# EAGLE design dev2-light (EAGLE 5.10)
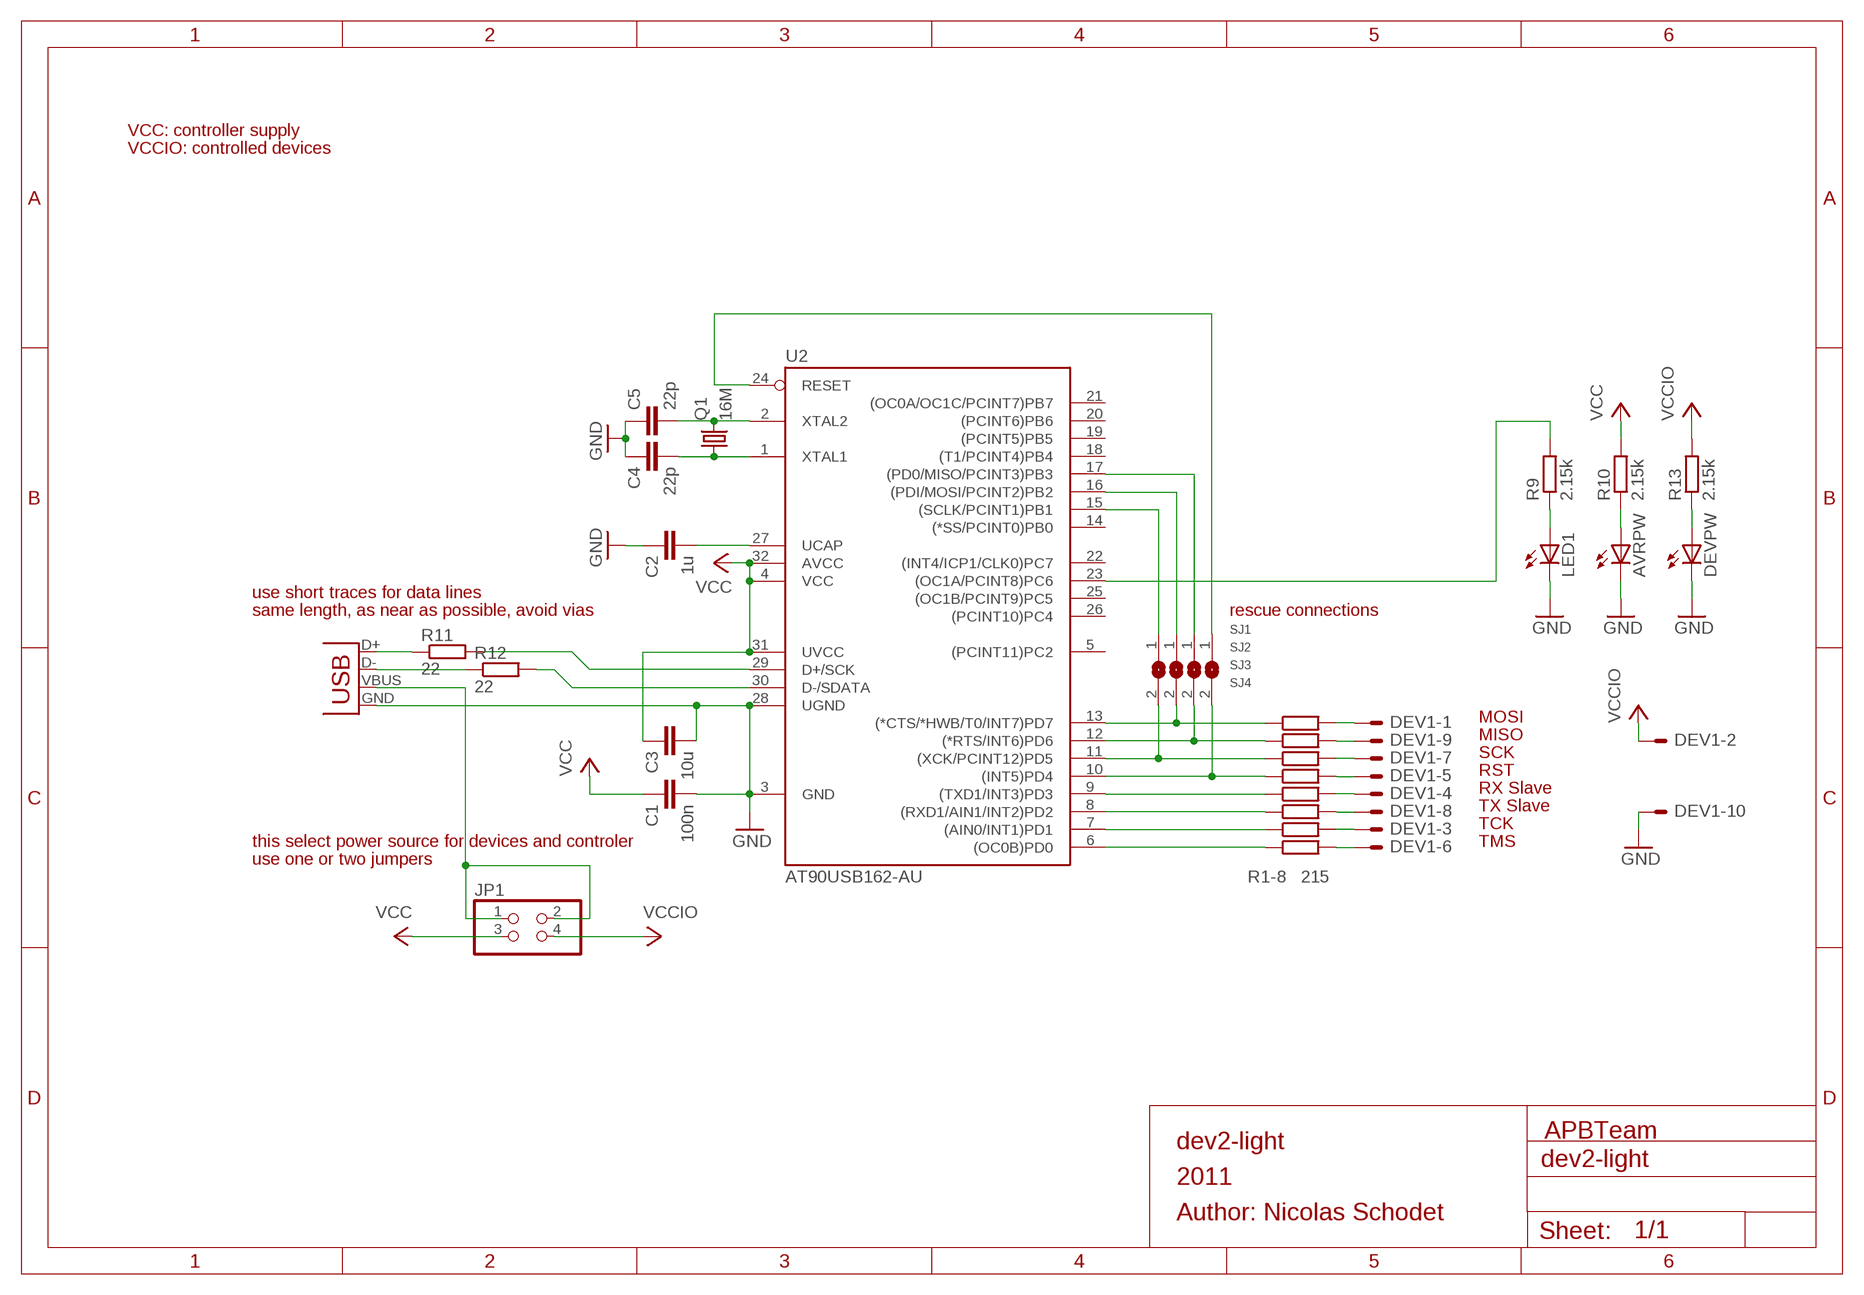
[diagram p0: schematic, sheet 1]

## Parts
AVRPW  LEDSMT1206  [1206]
C1  100n  C-EUC0603  [C0603]
C2  1u  C-EUC0603  [C0603]
C3  10u  C-EUC0603  [C0603]
C4  22p  C-EUC0603  [C0603]
C5  22p  C-EUC0603  [C0603]
DEV1  ML10E  [ML10]
DEVPW  LEDSMT1206  [1206]
JP1  PINHD-2X2  [2X02]
LED1  LEDSMT1206  [1206]
Q1  16M  QUARTZ  [ABM3]
R1  215  R-EU_R0603  [R0603]
R2  215  R-EU_R0603  [R0603]
R3  215  R-EU_R0603  [R0603]
R4  215  R-EU_R0603  [R0603]
R5  215  R-EU_R0603  [R0603]
R6  215  R-EU_R0603  [R0603]
R7  215  R-EU_R0603  [R0603]
R8  215  R-EU_R0603  [R0603]
R9  2.15k  R-EU_R0603  [R0603]
R10  2.15k  R-EU_R0603  [R0603]
R11  22  R-EU_R0603  [R0603]
R12  22  R-EU_R0603  [R0603]
R13  2.15k  R-EU_R0603  [R0603]
SJ1  SJ1SMD  [SJ1-SMD]
SJ2  SJ1SMD  [SJ1-SMD]
SJ3  SJ1SMD  [SJ1-SMD]
SJ4  SJ1SMD  [SJ1-SMD]
U2  AT90USB162-AU  [TQFP32-08]
X7  USB-MICROB-S  [USB-MICROB]

## Nets
AVRDM: R12.2 U2.30(D-/SDATA)
AVRDP: R11.2 U2.29(D+/SCK)
AVRPWLED: AVRPW.A R10.1
D0: R8.1 U2.6((OC0B)PD0)
D0D: DEV1.6 R8.2
D1: R7.1 U2.7((AIN0/INT1)PD1)
D1D: DEV1.3 R7.2
D2: R6.1 U2.8((RXD1/AIN1/INT2)PD2)
D2D: DEV1.8 R6.2
D3: R5.1 U2.9((TXD1/INT3)PD3)
D3D: DEV1.4 R5.2
D4: R4.1 SJ4.2 U2.10((INT5)PD4)
D4D: DEV1.5 R4.2
D5: R3.1 SJ1.2 U2.11((XCK/PCINT12)PD5)
D5D: DEV1.7 R3.2
D6: R2.1 SJ3.2 U2.12((*RTS/INT6)PD6)
D6D: DEV1.9 R2.2
D7: R1.1 SJ2.2 U2.13((*CTS/*HWB/T0/INT7)PD7)
D7D: DEV1.1 R1.2
DEVPWLED: DEVPW.A R13.1
DM: R12.1 X7.D-
DP: R11.1 X7.D+
GND [supply]: AVRPW.C C1.2 C2.1 C3.2 C4.1 C5.1 DEV1.10 DEVPW.C LED1.C U2.3(GND) U2.28(UGND) X7.GND
LED1L: LED1.A R9.1
MISO: SJ3.1 U2.17((PD0/MISO/PCINT3)PB3)
MOSI: SJ2.1 U2.16((PDI/MOSI/PCINT2)PB2)
PC6: R9.2 U2.23((OC1A/PCINT8)PC6)
RESET: SJ4.1 U2.24(RESET)
SCK: SJ1.1 U2.15((SCLK/PCINT1)PB1)
UCAP: C2.2 U2.27(UCAP)
VBUS: JP1.1 JP1.2 X7.VBUS
VCC [supply]: C1.1 C3.1 JP1.3 R10.2 U2.4(VCC) U2.31(UVCC) U2.32(AVCC)
VCCIO [supply]: DEV1.2 JP1.4 R13.2
XTAL1: C4.2 Q1.1 U2.1(XTAL1)
XTAL2: C5.2 Q1.2 U2.2(XTAL2)
Unconnected: U2.5((PCINT11)PC2) U2.14((*SS/PCINT0)PB0) U2.18((T1/PCINT4)PB4) U2.19((PCINT5)PB5) U2.20((PCINT6)PB6) U2.21((OC0A/OC1C/PCINT7)PB7) U2.22((INT4/ICP1/CLK0)PC7) U2.25((OC1B/PCINT9)PC5) U2.26((PCINT10)PC4)

## Notes on the sheet
- VCC: controller supply
- VCCIO: controlled devices
- use short traces for data lines
- same length, as near as possible, avoid vias | rescue connections
- MOSI
- MISO
- SCK
- RST
- RX Slave
- TX Slave
- TCK
- this select power source for devices and controler | TMS
- use one or two jumpers
- R1-8 | 215
- APBTeam
- dev2-light
- 2011
- Author: Nicolas Schodet

## Library data of the parts
AVRPW DEVPW LED1 = led:LED: LED OSRAM: - CHIPLED LG R971, LG N971, LY N971, LG Q971, LY Q971, LO R971, LY R971 LH N974, LH R974 LS Q976, LO Q976, LY Q976 LO Q996 - Hyper CHIPLED LW Q18S LB Q993, LB Q99A, LB R99A - SideLED LS A670, LO A670, LY A670, LG A670, LP A670 LB A673, LV A673, LT A673, LW A673 LH A674 LY A675 LS A676, LA A676, LO A676, LY A676, LW A676 LS A679, LY A679, LG A679 - Hyper Micro SIDELED® LS Y876, LA Y876, LO Y876, LY Y876 LT Y87S - SmartLED LW L88C, LW L88S LB L89C, LB L89S, LG L890 LS L89K, LO L89K, LY L89K LS L896, LA L896, LO L896, LY L896 - TOPLED LS T670, LO T670, LY T670, LG T670, LP T670 LSG T670, LSP T670, LSY T670, LOP T670, LYG T670 LG T671, LOG T671, LSG T671 LB T673, LV T673, LT T673, LW T673 LH T674 LS T676, LA T676, LO T676, LY T676, LB T676, LH T676, LSB T676, LW T676 LB T67C, LV T67C, LT T67C, LS T67K, LO T67K, LY T67K, LW E67C LS E67B, LA E67B, LO E67B, LY E67B, LB E67C, LV E67C, LT E67C LW T67C LS T679, LY T679, LG T679 LS T770, LO T770, LY T770, LG T770, LP T770 LB T773, LV T773, LT T773, LW T773 LH T774 LS E675, LA E675, LY E675, LS T675 LS T776, LA T776, LO T776, LY T776, LB T776 LHGB T686 LT T68C, LB T68C - Hyper Mini TOPLED® LB M676 - Mini TOPLED Santana® LG M470 LS M47K, LO M47K, LY M47K Source: http://www.osram.convergy.de LUXEON: - LUMILED® LXK2-PW12-R00, LXK2-PW12-S00, LXK2-PW14-U00, LXK2-PW14-V00 LXK2-PM12-R00, LXK2-PM12-S00, LXK2-PM14-U00 LXK2-PE12-Q00, LXK2-PE12-R00, LXK2-PE12-S00, LXK2-PE14-T00, LXK2-PE14-U00 LXK2-PB12-K00, LXK2-PB12-L00, LXK2-PB12-M00, LXK2-PB14-N00, LXK2-PB14-P00, LXK2-PB14-Q00 LXK2-PR12-L00, LXK2-PR12-M00, LXK2-PR14-Q00, LXK2-PR14-R00 LXK2-PD12-Q00, LXK2-PD12-R00, LXK2-PD12-S00 LXK2-PH12-R00, LXK2-PH12-S00 LXK2-PL12-P00, LXK2-PL12-Q00, LXK2-PL12-R00 Source: www.luxeon.com KINGBRIGHT: KA-3528ASYC Source: www.kingbright.com
C1-C5 = rcl:C-EU: CAPACITOR, European symbol
DEV1 = con-harting-ml:ML10?E: HARTING
JP1 = pinhead:PINHD-2X2: PIN HEADER
Q1 = ni-crystal:QUARTZ
R1-R13 = apbteam_rcl:R-EU_: RESISTOR, European symbol
SJ1-SJ4 = apbteam_jumper:SJ1: Jumper
U2 = at90usb:AT90USB162-*
X7 = apbteam_con-usb:USB: USB Connectors

## Net classes
1 supply: width 0.203 mm

## Board
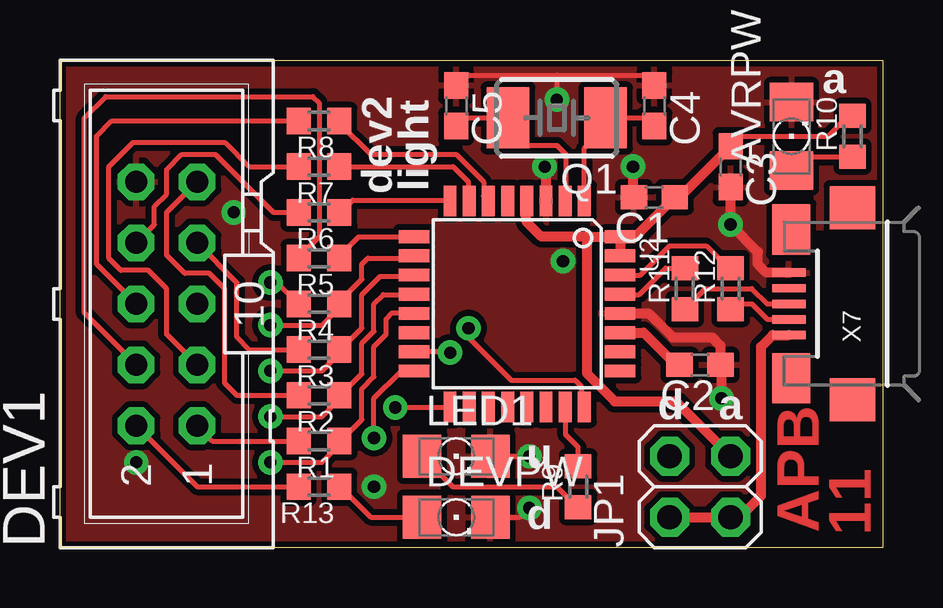
[diagram p1: board, top side]
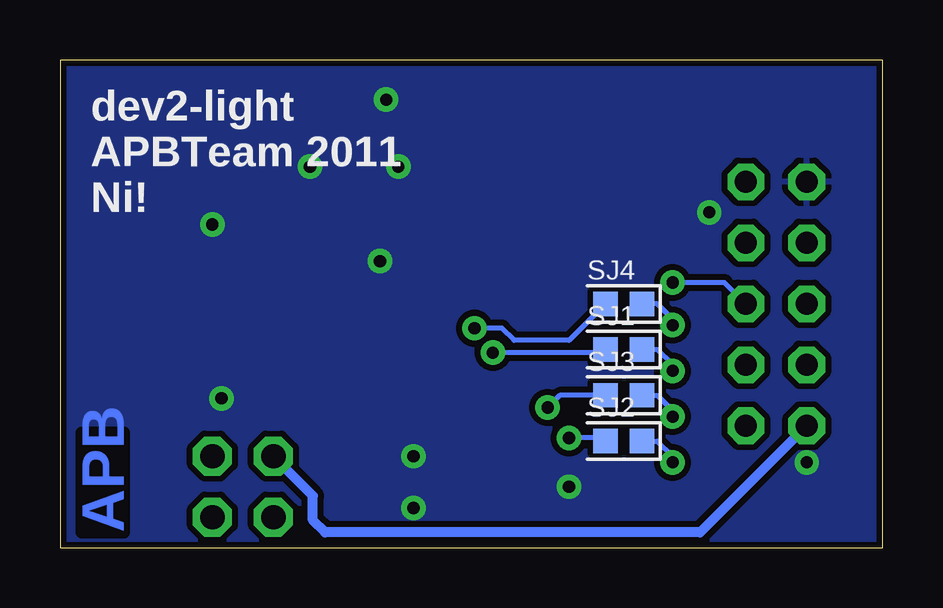
[diagram p2: board, bottom side, seen from below]

Size 34.29 x 20.32 mm. Coordinates in mm from the lower left corner, seen from the top.
Outline: 0,0 0,20.32 34.29,20.32 34.29,0 0,0
Copper layers (1*16): Top 0.035mm / dielectric 1.5mm / Bottom 0.035mm
Design rules "SparkFun": minimum track width 8mil, minimum drill 20mil, track to track 8mil, track to pad 8mil, pad to pad 8mil, via to via 8mil, smd to smd 8mil, copper to edge 10mil, drill to drill 8mil, minimum pad ring 12mil, minimum via ring 10mil, stop-mask expansion 4mil, vias tented up to drill 25mil, thermal gap 10mil
tRestrict: area 31.5,7.4 to 34.3,13

### Footprints (pad centres in the part's own frame; a part is rotated, then mirrored left to right if it is on the bottom)
1206 = smd 1.6 x 1.803: A -1.422,0; C 1.422,0
C0603 = smd 1.1 x 1: 1 -0.85,0; 2 0.85,0
ML10 = drill 0.914 octagon: 1 -5.08,-1.27; 2 -5.08,1.27; 3 -2.54,-1.27; 4 -2.54,1.27; 5 0,-1.27; 6 0,1.27; 7 2.54,-1.27; 8 2.54,1.27; 9 5.08,-1.27; 10 5.08,1.27
2X02 = drill 1.016 octagon: 1 -1.27,-1.27; 2 -1.27,1.27; 3 1.27,-1.27; 4 1.27,1.27
ABM3 = smd 1.778 x 2.54: 1 -2.032,0; 2 2.032,0
R0603 = smd 1 x 1.1: 1 -0.85,0; 2 0.85,0
SJ1-SMD = smd 1.016 x 1.016: 1 0.762,0; 2 -0.762,0
TQFP32-08 = smd 1.27 x 0.533: 1 -4.293,2.8; 2 -4.293,2; 3 -4.293,1.2; 4 -4.293,0.4; 5 -4.293,-0.4; 6 -4.293,-1.2; 7 -4.293,-2; 8 -4.293,-2.8; 17 4.293,-2.8; 18 4.293,-2; 19 4.293,-1.2; 20 4.293,-0.4; 21 4.293,0.4; 22 4.293,1.2; 23 4.293,2; 24 4.293,2.8 | smd 0.533 x 1.27: 9 -2.8,-4.293; 10 -2,-4.293; 11 -1.2,-4.293; 12 -0.4,-4.293; 13 0.4,-4.293; 14 1.2,-4.293; 15 2,-4.293; 16 2.8,-4.293; 25 2.8,4.293; 26 2,4.293; 27 1.2,4.293; 28 0.4,4.293; 29 -0.4,4.293; 30 -1.2,4.293; 31 -2,4.293; 32 -2.8,4.293
USB-MICROB = smd 0.35 x 1.4: D+ 0,2.65; D- -0.65,2.65; GND 1.3,2.65; ID 0.65,2.65; VBUS -1.3,2.65 | smd 1.8 x 1.9: MT1 -4,0; MT2 4,0 | smd 2.1 x 1.6: MT3 -3.1,2.55; MT4 3.1,2.55

### Placement (x,y rotation side)
AVRPW  30.48,17.14 90 top
C1  24.77,14.61 180 top
C2  26.67,7.62 180 top
C3  27.94,15.88 270 top
C4  24.77,18.41 270 top
C5  16.51,18.41 270 top
DEV1  4.45,10.16 90 top
DEVPW  16.51,1.27 0 top
JP1  26.67,2.54 90 top
LED1  16.51,3.81 0 top
Q1  20.7,17.91 180 top
R1  10.79,4.45 180 top
R2  10.79,6.35 180 top
R3  10.79,8.26 180 top
R4  10.79,10.16 180 top
R5  10.79,12.06 180 top
R6  10.79,13.97 180 top
R7  10.79,15.88 180 top
R8  10.79,17.78 180 top
R9  21.59,2.54 90 top
R10  33.02,17.14 90 top
R11  26.04,10.79 90 top
R12  27.94,10.79 90 top
R13  10.79,2.54 180 top
SJ1  10.79,8.26 180 bottom
SJ2  10.79,4.45 180 bottom
SJ3  10.79,6.35 180 bottom
SJ4  10.79,10.16 180 bottom
U2  19.05,10.16 270 top
X7  33.02,10.16 90 top

### Tracks (layer width: path | path; a pad name or v marks a point on that pad's centre or on a via)
AVRDM
  Top 0.203: R12.2 27.85,11.64 26.92,12.57 25.4,12.57 24.19,11.36 U2.30
AVRDP
  Top 0.203: R11.2 25.23,11.64 24.13,10.54 23.36,10.54 U2.29
AVRPWLED
  Top 0.203: R10.1 31.05,16.3 AVRPW.A
D0
  Top 0.203: R8.1 11.64,17.69 12.95,16.38 16.51,16.38 17.65,15.24 17.65,14.65 U2.6
D0D
  Top 0.203: R8.2 2.16,17.78 1.52,17.14 1.52,11.81 DEV1.6
D1
  Top 0.203: R7.1 16.38,15.88 17.02,15.24 17.02,14.48 U2.7
D1D
  Top 0.203: DEV1.3 4.45,8.89 4.45,10.79 3.68,11.56 2.54,11.56 2.03,12.06 2.03,15.88 3.05,16.89 6.86,16.89 7.87,15.88 R7.2
D2
  Top 0.203: R6.1 11.68,13.97 12.19,14.48 16.23,14.48 U2.8
D2D
  Top 0.203: R6.2 8.89,13.97 6.48,16.38 5.08,16.38 4.45,15.75 4.45,14.73 3.94,14.22 3.94,13.46 DEV1.8
D3
  Top 0.203: R5.1 11.64,12.15 12.45,12.95 U2.9
D3D
  Top 0.203: R5.2 9.95,12.1 10.79,12.95 10.79,18.54 10.54,18.8 1.91,18.8 1.02,17.91 1.02,9.78 DEV1.4
D4  (via drill 0.51)
  Top 0.203: U2.10 14.66,12.06 12.83,12.06 12.57,11.81 12.57,11.18 11.64,10.25 R4.1 11.64,9.99 10.92,9.27 v8.76,9.27
  Bottom 0.203: v8.76,9.27 8.76,9.53 9.4,10.16 SJ4.2
D4D  (via drill 0.51)
  Top 0.203: v8.76,11.05 9.06,11.05 R4.2
  Bottom 0.203: DEV1.5 6.6,11.05 v8.76,11.05
D5  (via drill 0.51)
  Top 0.203: U2.11 14.7,11.3 13.34,11.3 12.57,10.54 12.57,9.14 11.68,8.26 R3.1 11.64,8.09 10.92,7.37 v8.76,7.37
  Bottom 0.203: v8.76,7.37 8.76,7.62 9.4,8.26 SJ1.2
D5D
  Top 0.203: R3.2 7.87,8.26 7.37,8.76 7.37,11.05 DEV1.7
D6  (via drill 0.51)
  Top 0.203: U2.12 14.74,10.54 13.46,10.54 13.08,10.16 13.08,9.02 12.57,8.51 12.57,7.24 11.68,6.35 R2.1 11.64,6.18 10.92,5.46 v8.76,5.46
  Bottom 0.203: v8.76,5.46 8.76,5.71 9.4,6.35 SJ3.2
D6D
  Top 0.203: R2.2 7.37,6.35 6.86,6.86 6.86,10.79 6.22,11.43 5.21,11.43 4.45,12.19 4.45,13.97 DEV1.9
D7  (via drill 0.51)
  Top 0.203: U2.13 14.74,9.78 13.84,9.78 13.59,9.53 13.59,8.89 13.08,8.38 13.08,7.11 12.57,6.6 12.57,5.33 11.68,4.45 R1.1 11.64,4.28 10.92,3.56 v8.76,3.56
  Bottom 0.203: v8.76,3.56 8.76,3.81 9.4,4.45 SJ2.2
D7D
  Top 0.203: R1.2 6.35,4.45 DEV1.1
DEVPWLED
  Top 0.203: R13.1 11.68,2.54 12.95,1.27 DEVPW.A
DM
  Top 0.203: X7.D- 29.48,9.51 28.83,10.16 28.16,10.16 R12.1
DP
  Top 0.203: X7.D+ 29.46,10.16 28.83,10.79 26.89,10.79 R11.1
GND  (via drill 0.51)
  Top 0.203: DEVPW.C 19.18,1.27 v19.56,1.65 | LED1.C v19.56,3.81 | C5.1 16.6,19.27 17.02,19.68 20.7,19.68 | 20.7,19.68 24.34,19.68 C4.1 | 20.7,19.68 v20.7,18.67
  Top 0.406: U2.28 24.53,9.76 25.53,8.76 27.18,8.76 27.52,8.42 C2.1 27.56,7.62 v27.56,6.22 | X7.GND 29.43,11.46 29.08,11.81 29.08,12.32 v27.94,13.46 C3.2 | U2.3 20.25,15.69 v20.19,15.88 | C1.2 23.91,14.69 23.88,14.73 v23.88,15.88
  other vias: 3.17,3.56 20.95,11.94 7.24,13.97 13.08,2.54
  pour Bottom (isolate 0.254, rank 2): 0,20.32 34.29,20.32 34.29,0 0,0
  pour Top (isolate 0.254, rank 2): 0,20.32 34.29,20.32 34.29,0 0,0
LED1L
  Top 0.203: R9.1 21.55,1.69 20.7,2.54 16.36,2.54 LED1.A
MISO  (via drill 0.51)
  Top 0.203: v13.97,5.84 16.23,5.84 U2.17
  Bottom 0.203: SJ3.1 13.46,6.35 v13.97,5.84
MOSI  (via drill 0.51)
  Top 0.203: U2.16 14.22,7.36 13.08,6.22 v13.08,4.57
  Bottom 0.203: SJ2.1 11.68,4.57 v13.08,4.57
PC6
  Top 0.203: R9.2 21.59,4.19 21.08,4.7 21.08,5.83 U2.23
RESET  (via drill 0.51)
  Top 0.203: U2.24 21.85,6.34 21.72,6.48 21.72,6.73 21.46,6.99 18.8,6.99 17.02,8.76 v17.02,9.14
  Bottom 0.203: v17.02,9.14 15.88,9.14 15.37,8.64 13.08,8.64 SJ4.1
SCK  (via drill 0.51)
  Top 0.203: U2.15 16.22,8.16 v16.26,8.13
  Bottom 0.203: v16.26,8.13 11.68,8.13 SJ1.1
UCAP
  Top 0.406: U2.27 24.31,8.96 25.4,7.87 25.57,7.87 C2.2
VBUS
  Top 0.406: JP1.2 JP1.1 28.32,1.27 29.21,2.16 29.21,8.38 29.69,8.86 X7.VBUS
VCC
  Top 0.203: R10.2 32.85,18 32,17.14 28.16,17.14 27.94,16.93 C3.1 | U2.32 | 19.43,14.43 U2.4
  Top 0.406: U2.31 U2.32 21.97,12.96 | 21.97,12.96 20.06,12.96 19.43,13.59 19.43,14.43 | JP1.3 25.65,6.1 23.11,6.1 21.97,7.24 21.97,12.96 | C3.1 25.82,14.61 C1.1 23.96,12.95 U2.32
VCCIO
  Top 0.203: R13.2 5.71,2.54 DEV1.2
  Bottom 0.406: JP1.4 23.75,2.16 23.75,1.14 23.24,0.64 7.62,0.64 DEV1.2
XTAL1
  Top 0.203: U2.1 21.85,16.63 21.84,16.64 22.48,17.27 22.48,17.65 Q1.1 24.42,17.91 C4.2
XTAL2
  Top 0.203: U2.2 21.08,14.48 21.08,16.38 20.7,16.76 19.43,16.76 18.67,17.53 Q1.2 16.89,17.91 16.55,17.57 C5.2

### Text on the board
Top: APB | 11
Bottom: APB
tSilk: a | dev2 | light | d | a | u | d
bSilk: dev2-light | APBTeam 2011 | Ni!